# Altium schematic sheet RF_FILTER.SchDoc
size A4; DocumentNumber: 5; SheetNumber: 10; SheetTotal: 18
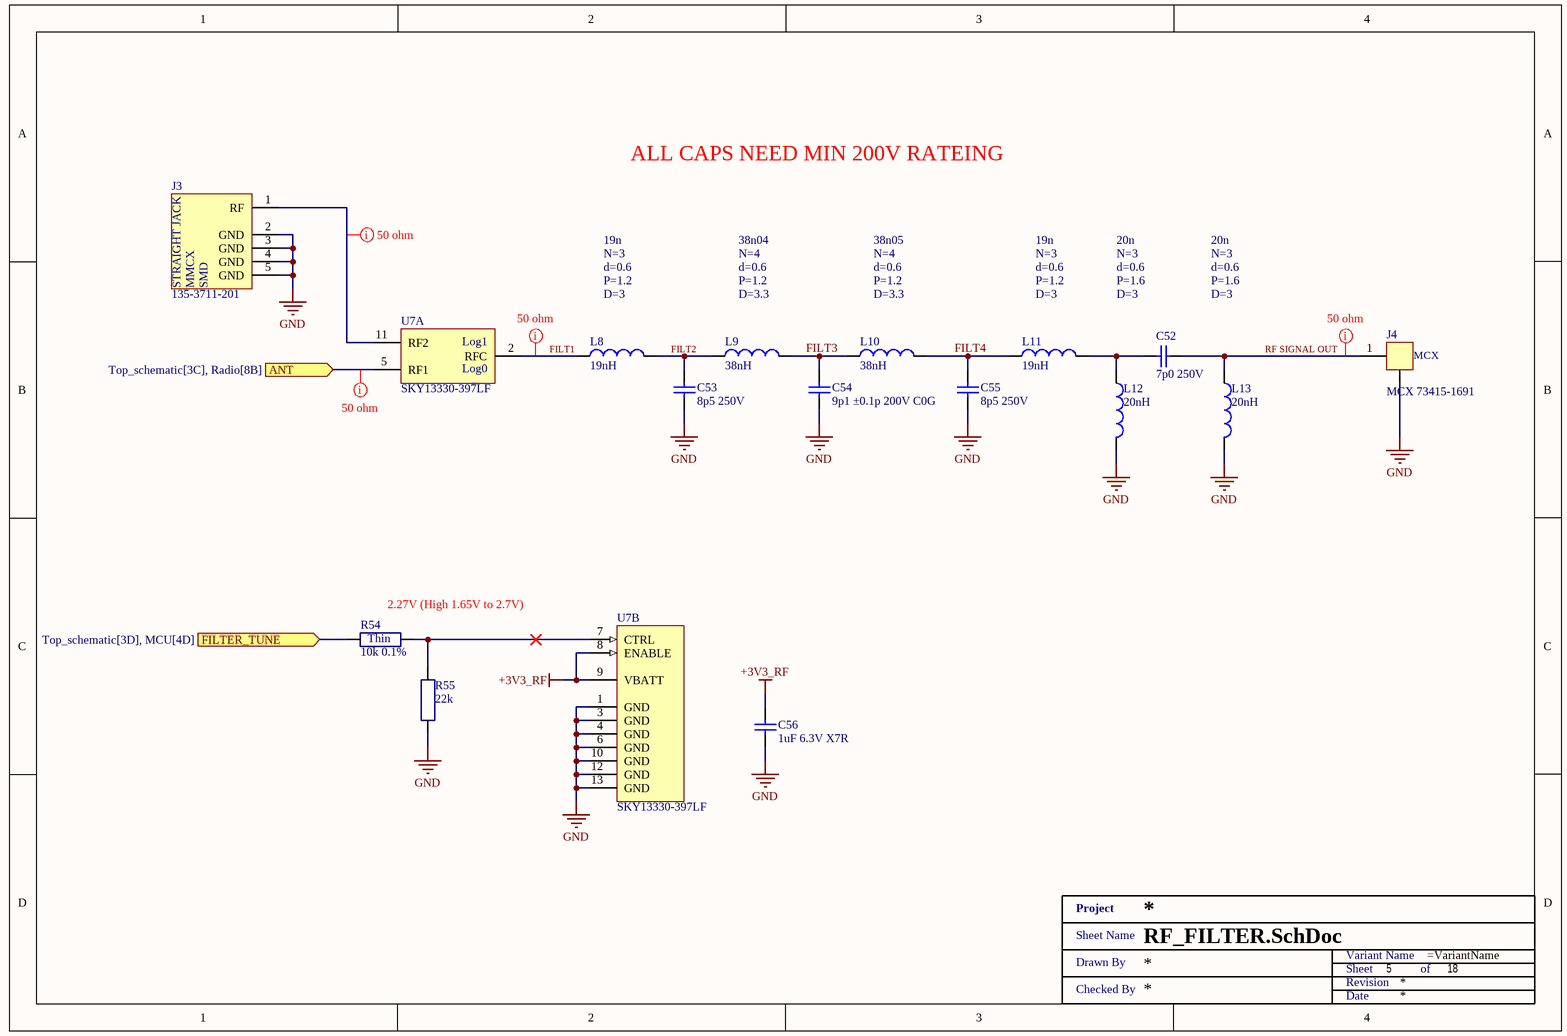
[diagram p0: RF_FILTER.SchDoc]

## Parts
C52  7p0 250V  [SMD0603]
C53  8p5 250V  [SMD0603]
C54  9p1 ±0.1p 200V C0G  [SMD0603]
C55  8p5 250V  [SMD0603]
C56  1uF 6.3V X7R  [SMD0402]
J3  135-3711-201  [135-3711-201]
J4  MCX 73415-1691  [MCX_SMD_vertical]
L8  19nH  [Air-Inductor-25nH]
L9  38nH  [Air-Inductor-40nH]
L10  38nH  [Air-Inductor-40nH]
L11  19nH  [Air-Inductor-25nH]
L12  20nH  [Air-Inductor-25nH]
L13  20nH  [Air-Inductor-25nH]
R54  10k 0.1%  [SMD0402 - R]
R55  22k  [SMD0402 - R]
U7  SKY13330-397LF  [QFN50P200X200X100_HS-13N]  (parts A,B of 2)
XX?  Title 1  (value not drawn)  (graphical)

## Ports
ANT (in, see Top_schematic[3C], Radio[8B]), FILTER_TUNE (in, see Top_schematic[3D], MCU[4D])

## Nets
+3V3_RF: C56.2 U7.8(ENABLE) U7.9(VBATT)
GND: C53.1 C54.1 C55.1 C56.1 J3.2(GND) J3.3(GND) J3.4(GND) J3.5(GND) J4.2(GND) L12.2 L13.2 R55.1 U7.1(GND) U7.3(GND) U7.4(GND) U7.6(GND) U7.10(GND) U7.12(GND) U7.13(GND)
ANT: U7.5(RF1) ; port ANT
FILT1: L8.1 U7.2(RFC)
FILT2: C53.2 L8.2 L9.1
FILT3: C54.2 L9.2 L10.1
FILT4: C55.2 L10.2 L11.1
FILTER_TUNE: R54.1 ; port FILTER_TUNE
RF SIGNAL OUT: C52.2 J4.1(INPUT) L13.1
NetC52_1: C52.1 L11.2 L12.1
NetJ3_1: J3.1(RF) U7.11(RF2)
NetR54_2: R54.2 R55.2 U7.7(CTRL)

## Layout directives
net class 50 ohm: ANT, FILT1, NetJ3_1, RF SIGNAL OUT

## Notes on the sheet
- ALL CAPS NEED MIN 200V RATEING
- 19n
- 38n04
- 38n05
- 20n
- N=3
- d=0.6
- P=1.2
- D=3
- N=4
- D=3.3
- P=1.6
- (near R54) 2.27V (High 1.65V to 2.7V)
- (in symbol 135-3711-201) STRAIGHT JACK; MMCX; SMD
- (in symbol SKY13330-397LF, part A) Log1; Log0
- (in symbol TC0225B1002TCC) Thin
- (in symbol Title 1) Project; Sheet Name; Variant Name; Drawn By; Sheet; of; Revision; Checked By; Date

## Library data of the parts
C52 = GQM1875C2E7R0BB12D: Multilayer Ceramic Capacitors MLCC - SMD/SMT 7 pF 250 VDC 0.1 pF 0603 C0G (NP0); Manufacturer: Murata; Manufacturer Lifecycle Status: IN PRODUCTION; Temperature Coefficient: 30ppm/°C; Supplier 1: Mouser; Supplier Part Number 1: 81-GQM1875C2E7R0BB2D; Manufacturer Part Number: GQM1875C2E7R0BB12D; RoHS: Compliant; Category: Ceramic Capacitors; Stock 1: 4746; Pricing 1: 1=0.37, 10=0.245, 50=0.245, 100=0.153, 1000=0.113, 10000=0.088 (USD); Capacitance: 7p0; Case/Package: 0603; Case Code (Imperial): 0603; Case Code (Metric): 1608; Dielectric: C0G; Dielectric Material: Ceramic; Height: 700µm; Length: 1.6mm; Lifecycle Status: Production; Material: Ceramic; Max Operating Temperature: 125°C; Min Operating Temperature: -55°C; Mounting Technology: Surface Mount; Number of Terminals: 2; REACH SVHC: Yes; Termination: SMD/SMT; Thickness: 700µm; Voltage Rating: 250V; Voltage Rating (DC): 250V; Width: 800µm; ComponentLink1URL: https://datasheet.octopart.com:443/GQM1875C2E7R0BB12D-Murata-datasheet-165579666.pdf?src-supplier=TME; ComponentLink1Description: https://datasheet.octopart.com:443/GQM1875C2E7R0BB12D-Murata-datasheet-165579666.pdf?src-supplier=TME; ComponentLink2URL: https://datasheet.octopart.com:443/GQM1875C2E7R0BB12D-Murata-datasheet-141271601.pdf?src-supplier=Ciiva; ComponentLink2Description: https://datasheet.octopart.com:443/GQM1875C2E7R0BB12D-Murata-datasheet-141271601.pdf?src-supplier=Ciiva; ComponentLink3URL: https://datasheet.octopart.com:443/GQM1875C2E7R0BB12D-Murata-datasheet-140667024.pdf?src-supplier=Ciiva; ComponentLink3Description: https://datasheet.octopart.com:443/GQM1875C2E7R0BB12D-Murata-datasheet-140667024.pdf?src-supplier=Ciiva; ComponentLink4URL: https://datasheet.octopart.com:443/GQM1875C2E7R0BB12D-Murata-datasheet-138726837.pdf?src-supplier=Ciiva; ComponentLink4Description: https://datasheet.octopart.com:443/GQM1875C2E7R0BB12D-Murata-datasheet-138726837.pdf?src-supplier=Ciiva; ComponentLink5URL: https://datasheet.octopart.com/GQM1875C2E7R0BB12D-Murata-datasheet-12515295.pdf; ComponentLink5Description: https://datasheet.octopart.com/GQM1875C2E7R0BB12D-Murata-datasheet-12515295.pdf; ComponentLink6URL: https://datasheet.octopart.com/GQM1875C2E7R0BB12D-Murata-datasheet-12510076.pdf; ComponentLink6Description: https://datasheet.octopart.com/GQM1875C2E7R0BB12D-Murata-datasheet-12510076.pdf; ComponentLink7URL: https://datasheet.octopart.com/GQM1875C2E7R0BB12D-Murata-datasheet-11978611.pdf; ComponentLink7Description: https://datasheet.octopart.com/GQM1875C2E7R0BB12D-Murata-datasheet-11978611.pdf; ComponentLink8URL: https://datasheet.octopart.com/GQM1875C2E7R0BB12D-Murata-datasheet-10025737.pdf; ComponentLink8Description: https://datasheet.octopart.com/GQM1875C2E7R0BB12D-Murata-datasheet-10025737.pdf; ComponentLink9URL: https://datasheet.octopart.com/GQM1875C2E7R0BB12D-Murata-datasheet-8819587.pdf; ComponentLink9Description: https://datasheet.octopart.com/GQM1875C2E7R0BB12D-Murata-datasheet-8819587.pdf; ComponentLink10URL: https://datasheet.octopart.com/GQM1875C2E7R0BB12D-Murata-datasheet-14407235.pdf; ComponentLink10Description: https://datasheet.octopart.com/GQM1875C2E7R0BB12D-Murata-datasheet-14407235.pdf; ComponentLink11URL: http://sigma.octopart.com:80/reach_statement/Murata-company-16.pdf?src-supplier=Compliance+Statements; ComponentLink11Description: http://sigma.octopart.com:80/reach_statement/Murata-company-16.pdf?src-supplier=Compliance+Statements
C53 C55 = GQM1875C2E8R5CB12D: Multilayer Ceramic Capacitors MLCC - SMD/SMT 8.5 pF 250 VDC 0.25 pF 0603 C0G (NP0); Manufacturer: Murata; Manufacturer Lifecycle Status: IN PRODUCTION; Temperature Coefficient: 30ppm/°C; Supplier 1: Mouser; Supplier Part Number 1: 81-GQM1875C2E8R5CB2D; Manufacturer Part Number: GQM1875C2E8R5CB12D; RoHS: Compliant; Category: Ceramic Capacitors; Stock 1: 3504; Pricing 1: 1=0.44, 10=0.257, 50=0.257, 100=0.155, 1000=0.105, 10000=0.08 (USD); Capacitance: 8p5; Case/Package: 0603; Dielectric: C0G; Dielectric Material: Ceramic; Export Control Classification Number (ECCN) Code: EAR99; Height: 700µm; Harmonized Tariff Schedule (HTS) Code: 8532.24.00.20; Introduction Date: 2013-11-20; Length: 1.6mm; Lifecycle Status: Production; Material: Ceramic; Max Operating Temperature: 125°C; Min Operating Temperature: -55°C; Mounting Technology: Surface Mount; Number of Terminals: 2; REACH SVHC: Yes; Thickness: 700µm; Voltage Rating: 250V; Voltage Rating (DC): 250V; Width: 800µm; ComponentLink1URL: https://datasheet.octopart.com:443/GQM1875C2E8R5CB12D-Murata-datasheet-165579666.pdf?src-supplier=TME; ComponentLink1Description: https://datasheet.octopart.com:443/GQM1875C2E8R5CB12D-Murata-datasheet-165579666.pdf?src-supplier=TME; ComponentLink2URL: https://datasheet.octopart.com:443/GQM1875C2E8R5CB12D-Murata-datasheet-141271613.pdf?src-supplier=Ciiva; ComponentLink2Description: https://datasheet.octopart.com:443/GQM1875C2E8R5CB12D-Murata-datasheet-141271613.pdf?src-supplier=Ciiva; ComponentLink3URL: https://datasheet.octopart.com:443/GQM1875C2E8R5CB12D-Murata-datasheet-140667088.pdf?src-supplier=Ciiva; ComponentLink3Description: https://datasheet.octopart.com:443/GQM1875C2E8R5CB12D-Murata-datasheet-140667088.pdf?src-supplier=Ciiva; ComponentLink4URL: https://datasheet.octopart.com:443/GQM1875C2E8R5CB12D-Murata-datasheet-138726904.pdf?src-supplier=Ciiva; ComponentLink4Description: https://datasheet.octopart.com:443/GQM1875C2E8R5CB12D-Murata-datasheet-138726904.pdf?src-supplier=Ciiva; ComponentLink5URL: https://datasheet.octopart.com/GQM1875C2E8R5CB12D-Murata-datasheet-12515295.pdf; ComponentLink5Description: https://datasheet.octopart.com/GQM1875C2E8R5CB12D-Murata-datasheet-12515295.pdf; ComponentLink6URL: https://datasheet.octopart.com/GQM1875C2E8R5CB12D-Murata-datasheet-12510076.pdf; ComponentLink6Description: https://datasheet.octopart.com/GQM1875C2E8R5CB12D-Murata-datasheet-12510076.pdf; ComponentLink7URL: https://datasheet.octopart.com/GQM1875C2E8R5CB12D-Murata-datasheet-11978611.pdf; ComponentLink7Description: https://datasheet.octopart.com/GQM1875C2E8R5CB12D-Murata-datasheet-11978611.pdf; ComponentLink8URL: https://datasheet.octopart.com/GQM1875C2E8R5CB12D-Murata-datasheet-10025737.pdf; ComponentLink8Description: https://datasheet.octopart.com/GQM1875C2E8R5CB12D-Murata-datasheet-10025737.pdf; ComponentLink9URL: https://datasheet.octopart.com/GQM1875C2E8R5CB12D-Murata-datasheet-8819587.pdf; ComponentLink9Description: https://datasheet.octopart.com/GQM1875C2E8R5CB12D-Murata-datasheet-8819587.pdf; ComponentLink10URL: http://sigma.octopart.com:80/reach_statement/Murata-company-16.pdf?src-supplier=Compliance+Statements; ComponentLink10Description: http://sigma.octopart.com:80/reach_statement/Murata-company-16.pdf?src-supplier=Compliance+Statements
C54 = 06032U9R1BAT2A: Cap SMD U" Series Low ESR 0603 200V C0G (NP0) 9.1pF ±0.1pF for Comm/RF/µWave Apps Ni/Sn Plated 7"T/R"; Manufacturer: Kyocera AVX; Supplier 1: Mouser; Supplier Part Number 1: 581-06032U9R1BAT2A; Manufacturer Part Number: 06032U9R1BAT2A; RoHS: Yes; Category: Ceramic Capacitors; Stock 1: 4736; Pricing 1: 1=0.3, 10=0.201, 50=0.201, 100=0.114, 1000=0.074, 10000=0.058 (USD); ComponentLink1URL: https://datasheet.ciiva.com/207/useries-207450.pdf?src-supplier=Digikey; ComponentLink1Description: https://datasheet.ciiva.com/207/useries-207450.pdf?src-supplier=Digikey; Capacitance: 9p1
C56 = TCC0402X7R105K6R3AT: Capacitor: MLCC; SMD; 0402; 1µF; 6.3V; ±10%; X7R; CCTC; Capacitance: 1u; Supplier 1: LCSC; Supplier Part Number 1: C5448871; Manufacturer: CCTC; Manufacturer Part Number: TCC0402X7R105K6R3AT; Category: Ceramic Capacitors; Stock 1: 242350; Pricing 1: 50=0.0089, 500=0.0072, 1500=0.0063, 10000=0.0058, 20000=0.0053, 50000=0.005 (USD); ComponentLink1URL: https://datasheet.octopart.com:443/TCC0402X7R105K6R3AT-CCTC-datasheet-194166649.pdf?src-supplier=LCSC; ComponentLink1Description: https://datasheet.octopart.com:443/TCC0402X7R105K6R3AT-CCTC-datasheet-194166649.pdf?src-supplier=LCSC; ComponentLink2URL: https://datasheet.octopart.com:443/TCC0402X7R105K6R3AT-CCTC-datasheet-192317456.pdf?src-supplier=HQonline; ComponentLink2Description: https://datasheet.octopart.com:443/TCC0402X7R105K6R3AT-CCTC-datasheet-192317456.pdf?src-supplier=HQonline
J3 = 135-3711-201: MMCX -   50 Ohm Connectors; Manufacturer: JOHNSON - CINCH CONNECTIVITY; Supplier 1: Mouser; Supplier Part Number 1: 530-135-3711-201; Manufacturer Part Number: 135-3711-201; RoHS: No; Stock 1: 1530; Pricing 1: 1=4.04000, 10=3.40000, 50=3.40000, 100=3.23000, 1000=2.95000, 10000=2.18000 (USD); ComponentLink1URL: http://www.farnell.com/datasheets/2341587.pdf?src-supplier=Farnell; ComponentLink1Description: http://www.farnell.com/datasheets/2341587.pdf?src-supplier=Farnell; ComponentLink2URL: http://www.farnell.com/datasheets/2341587.pdf?src-supplier=Newark; ComponentLink2Description: http://www.farnell.com/datasheets/2341587.pdf?src-supplier=Newark; Supplier 2: Farnell; Supplier Part Number 2: 1417969; Supplier 3: Arrow Electronics; Supplier Part Number 3: 135-3711-201
J4 = 73415-1691: MOLEX - 73415-1691 - RF COAXIAL, MCX, STRAIGHT JACK, 50OHM; Connector Type: MCX Coaxial; Coaxial Termination: Surface Mount Vertical; Impedance: 50; Frequency Max: 6; Connector Mounting: PCB Mount; Contact Termination: Solder; Body Material: Brass; Body Finish: Gold; Dielectric Material: Polytetrafluoroethylene (PTFE); Center Contact Material: Beryllium Copper; Mating Cycles: 500; Manufacturer: MOLEX; Manufacturer Part Number: 73415-1691; RoHS: YES; Stock 1: 733; Pricing 1: 1=1.65, 10=1.4, 50=1.25, 100=1.13, 250=1.06, 500=0.995 (GBP); Connector Body Style: Straight Jack; Coaxial Cable Types: -; Contact Material: Beryllium Copper; Contact Plating: Gold Plated Contacts; Product Range: -; Termination Method: Surface Mount<!--FANDB--><div class="features-and-benefits-container"><div class="features-and-benefits-description"><span class="features-benefits-value">The 73415-1691 is a vertical surface-mount MCX Straight Jack Receptacle made of gold-plated brass body with gold-plated beryllium copper centre contact and a Teflon insulator.</span></div><div class="features-and-benefits-applications"><ul class="features-and-benefits-value"><li class="features-and-benefits-list-item">RF Communications</li><li class="features-and-benefits-list-item">Industrial</li></ul></div></div>; ComponentLink1URL: http://www.farnell.com/cad/1518410.pdf; ComponentLink1Description: http://www.farnell.com/cad/1518410.pdf; ComponentLink2URL: http://www.farnell.com/datasheets/2133682.pdf; ComponentLink2Description: http://www.farnell.com/datasheets/2133682.pdf; Category: Connectors, Interconnects; Stock 4: 39394; Pricing 4: 1=1.95, 10=1.765, 25=1.6572, 50=1.5854, 100=1.5133, 250=1.36916, 500=1.26106, 1000=1.0809, 2500=1.00884 (USD); Packaging: Tray; Part Status: Active; Connector Style: MCX; Shield Termination: Solder; Mounting Type: Through Hole; Mounting Feature: -; Cable Group: -; Fastening Type: Snap-On; Features: -; Housing Color: Gold; Ingress Protection: -; Includes: -; Center Contact Plating: Gold; Operating Temperature: -55°C ~ 155°C; Insertion Loss: -; ComponentLink3URL: https://www.molex.com/pdm_docs/sd/733660061_sd.pdf; ComponentLink3Description: https://www.molex.com/pdm_docs/sd/733660061_sd.pdf; Supplier 1: Mouser; Supplier Part Number 1: 538-73415-1691; Supplier 2: Farnell; Supplier Part Number 2: 1909246; Supplier 3: Digi-Key; Supplier Part Number 3: WM5559-ND; Supplier 4: Digi-Key; Supplier Part Number 4: WM5541-ND
L8 L11-L13 = Air-Inductor_20nH
L9 L10 = Air-Inductor_40nH
R54 = TC0225B1002TCC: Fixed Resistor, Thin Film, 0.0625W, 10000ohm, 50V, 0.1% +/-Tol, Surface Mount, 0402; Manufacturer: Uniroyal; Power Rating: 62.5mW; Supplier 1: LCSC; Supplier Part Number 1: C2989267; Manufacturer Part Number: TC0225B1002TCC; Category: Chip SMD Resistors; Stock 1: 10200; Pricing 1: 20=0.0396, 200=0.0352, 600=0.0327, 2000=0.0312, 10000=0.0299, 20000=0.0292 (USD); Case/Package: 0402; Composition: Thin Film; Export Control Classification Number (ECCN) Code: EAR99; Height: 300µm; Harmonized Tariff Schedule (HTS) Code: 8533.21.00.30; Length: 1mm; Lifecycle Status: Production; Max Operating Temperature: 155°C; Min Operating Temperature: -55°C; Mounting Technology: Surface Mount; Number of Terminals: 2; Resistance: 10k; Tolerance: 0.1%; Width: 500µm; Working Voltage: 50V; ComponentLink1URL: https://datasheet.octopart.com:443/TC0225B1002TCC-Uniroyal-datasheet-194228365.pdf?src-supplier=LCSC; ComponentLink1Description: https://datasheet.octopart.com:443/TC0225B1002TCC-Uniroyal-datasheet-194228365.pdf?src-supplier=LCSC
R55 = RC0402FR-0722KL: Res Thick Film 0402 22K Ohm 1% 0.063W(1/16W) ±100ppm/C Pad SMD T/R; Manufacturer: Yageo Group; Max Power Dissipation: 63mW; Power Rating: 62.5mW; Temperature Coefficient: 100ppm/°C; Voltage Rating: 50V; Supplier 1: Mouser; Supplier Part Number 1: 603-RC0402FR-0722KL; Manufacturer Part Number: RC0402FR-0722KL; RoHS: Compliant; Category: Chip SMD Resistors; Stock 1: 473074; Pricing 1: 1=0.1, 10=0.009, 50=0.009, 100=0.007, 1000=0.006, 10000=0.002 (USD); Case/Package: 0402; Case Code (Imperial): 0402; China RoHS: Non-Compliant; Composition: Thick Film; Depth: 500µm; Features: Moisture Resistant; Height: 350µm; Lead Free: Lead Free; Length: 1mm; Lifecycle Status: Production; Max Operating Temperature: 155°C; Military Standard: Not; Min Operating Temperature: -55°C; Mounting Technology: Surface Mount; Pins: 2; Number of Terminals: 2; Number of Terminations: 2; Packaging: Tape & Reel; REACH SVHC: Yes; Resistance: 22k; Schedule B: 8533210045, 8533210045|8533210045, 8533210045|8533210045|8533210045, 8533210045|8533210045|8533210045|8533210045; Termination: SMD/SMT; Tolerance: 1%; Voltage Rating (AC): 50V; Voltage Rating (DC): 50V; Width: 500µm; Working Voltage: 50V; ComponentLink1URL: https://datasheet.octopart.com:443/RC0402FR-0722KL-Yageo-datasheet-175887523.pdf?src-supplier=IHS; ComponentLink1Description: https://datasheet.octopart.com:443/RC0402FR-0722KL-Yageo-datasheet-175887523.pdf?src-supplier=IHS; ComponentLink2URL: https://datasheet.octopart.com:443/RC0402FR-0722KL-Yageo-datasheet-10408619.pdf?src-supplier=element14+APAC; ComponentLink2Description: https://datasheet.octopart.com:443/RC0402FR-0722KL-Yageo-datasheet-10408619.pdf?src-supplier=element14+APAC; ComponentLink3URL: https://datasheet.octopart.com:443/RC0402FR-0722KL-Yageo-datasheet-62067350.pdf?src-supplier=element14+APAC; ComponentLink3Description: https://datasheet.octopart.com:443/RC0402FR-0722KL-Yageo-datasheet-62067350.pdf?src-supplier=element14+APAC; ComponentLink4URL: https://datasheet.octopart.com:443/RC0402FR-0722KL-Yageo-datasheet-103092701.pdf?src-supplier=Upverter; ComponentLink4Description: https://datasheet.octopart.com:443/RC0402FR-0722KL-Yageo-datasheet-103092701.pdf?src-supplier=Upverter; ComponentLink5URL: https://datasheet.octopart.com:443/RC0402FR-0722KL-Yageo-Group-datasheet-190305687.pdf?src-supplier=Future+Electronics; ComponentLink5Description: https://datasheet.octopart.com:443/RC0402FR-0722KL-Yageo-Group-datasheet-190305687.pdf?src-supplier=Future+Electronics; ComponentLink6URL: https://datasheet.octopart.com:443/RC0402FR-0722KL-Yageo-datasheet-164759695.pdf?src-supplier=Future+Electronics; ComponentLink6Description: https://datasheet.octopart.com:443/RC0402FR-0722KL-Yageo-datasheet-164759695.pdf?src-supplier=Future+Electronics; ComponentLink7URL: https://datasheet.octopart.com:443/RC0402FR-0722KL-Yageo-datasheet-137700087.pdf?src-supplier=Future+Electronics; ComponentLink7Description: https://datasheet.octopart.com:443/RC0402FR-0722KL-Yageo-datasheet-137700087.pdf?src-supplier=Future+Electronics; ComponentLink8URL: https://datasheet.octopart.com:443/RC0402FR-0722KL-Yageo-datasheet-12531192.pdf?src-supplier=Future+Electronics; ComponentLink8Description: https://datasheet.octopart.com:443/RC0402FR-0722KL-Yageo-datasheet-12531192.pdf?src-supplier=Future+Electronics; ComponentLink9URL: https://datasheet.octopart.com:443/RC0402FR-0722KL-Yageo-datasheet-8324255.pdf?src-supplier=Future+Electronics; ComponentLink9Description: https://datasheet.octopart.com:443/RC0402FR-0722KL-Yageo-datasheet-8324255.pdf?src-supplier=Future+Electronics; ComponentLink10URL: https://datasheet.octopart.com:443/RC0402FR-0722KL-Yageo-datasheet-8329306.pdf?src-supplier=element14; ComponentLink10Description: https://datasheet.octopart.com:443/RC0402FR-0722KL-Yageo-datasheet-8329306.pdf?src-supplier=element14; ComponentLink11URL: https://datasheet.octopart.com:443/RC0402FR-0722KL-Yageo-datasheet-8324527.pdf?src-supplier=Newark; ComponentLink11Description: https://datasheet.octopart.com:443/RC0402FR-0722KL-Yageo-datasheet-8324527.pdf?src-supplier=Newark; ComponentLink12URL: https://datasheet.octopart.com:443/RC0402FR-0722KL-Yageo-Group-datasheet-189192902.pdf?src-supplier=LCSC; ComponentLink12Description: https://datasheet.octopart.com:443/RC0402FR-0722KL-Yageo-Group-datasheet-189192902.pdf?src-supplier=LCSC; ComponentLink13URL: https://datasheet.octopart.com:443/RC0402FR-0722KL-Yageo-datasheet-175423674.pdf?src-supplier=SOS+electronic; ComponentLink13Description: https://datasheet.octopart.com:443/RC0402FR-0722KL-Yageo-datasheet-175423674.pdf?src-supplier=SOS+electronic; ComponentLink14URL: https://datasheet.octopart.com:443/RC0402FR-0722KL-Yageo-datasheet-148775077.pdf?src-supplier=TME; ComponentLink14Description: https://datasheet.octopart.com:443/RC0402FR-0722KL-Yageo-datasheet-148775077.pdf?src-supplier=TME; ComponentLink15URL: https://datasheet.octopart.com:443/RC0402FR-0722KL-Yageo-datasheet-79472498.pdf?src-supplier=Megastar; ComponentLink15Description: https://datasheet.octopart.com:443/RC0402FR-0722KL-Yageo-datasheet-79472498.pdf?src-supplier=Megastar; ComponentLink16URL: https://datasheet.octopart.com/RC0402FR-0722KL-Yageo-datasheet-73766026.pdf; ComponentLink16Description: https://datasheet.octopart.com/RC0402FR-0722KL-Yageo-datasheet-73766026.pdf; ComponentLink17URL: http://sigma.octopart.com:80/conflict_mineral_statement/Yageo-company-3.pdf?src-supplier=Compliance+Statements; ComponentLink17Description: http://sigma.octopart.com:80/conflict_mineral_statement/Yageo-company-3.pdf?src-supplier=Compliance+Statements; ComponentLink18URL: http://sigma.octopart.com:80/rohs_statement/Yageo-company-2.pdf?src-supplier=Compliance+Statements; ComponentLink18Description: http://sigma.octopart.com:80/rohs_statement/Yageo-company-2.pdf?src-supplier=Compliance+Statements; Supplier 2: LCSC; Supplier Part Number 2: C82868
U7 = SKY13330-397LF: RF Switch SP2T 100MHz to 6GHz 16dB Automotive 12-Pin QFN EP; Manufacturer: Skyworks Solutions; Throw Configuration: SPDT; P1dB: 39dBm; Impedance: 50R; Insertion Loss: 0.65dB; Turn-Off Delay Time: 1.6us; Supplier 1: Mouser; Supplier Part Number 1: 873-SKY13330-397LF; Manufacturer Part Number: SKY13330-397LF; RoHS: Yes; Category: RF Semiconductors and Devices; Pricing 1: 1=1.02000, 10=0.86600, 50=0.86600, 100=0.66600, 500=0.58800, 1000=0.46500, 3000=0.43000, 10000=0.43000 (USD); Mount: Surface Mount; Case/Package: QFN; Number of Pins: 12; Contact Plating: Tin,Matte; Weight: 0.000776oz; Min Operating Temperature: -40°C; Max Operating Temperature: 85°C; Frequency: 100MHz; Packaging: Tape and Reel; Package Quantity: 3000; Turn-On Delay Time: 1.6us; Max Frequency: 6GHz; Radiation Hardening: No; ComponentLink1URL: https://datasheet.ciiva.com/15100/getdatasheetpartid-656010-15100460.pdf?src-supplier=Verical; ComponentLink1Description: https://datasheet.ciiva.com/15100/getdatasheetpartid-656010-15100460.pdf?src-supplier=Verical; Supplier 2: Digi-Key; Supplier Part Number 2: 863-1643-2-ND; Supplier 3: Arrow Electronics; Supplier Part Number 3: SKY13330-397LF